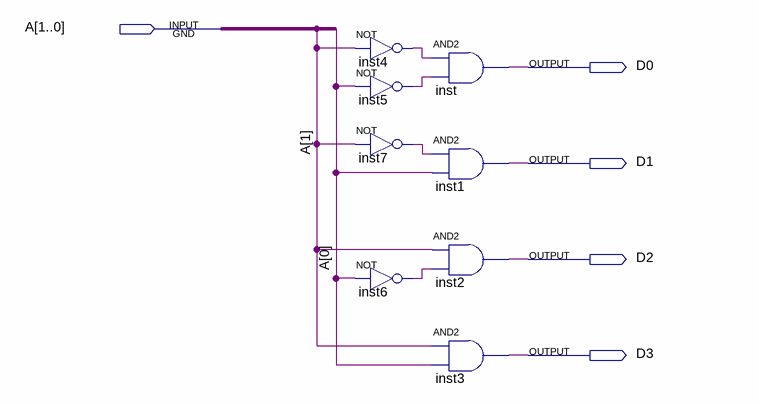
[diagram p0: schematic sheet]
// Quartus schematic dc2_4.bdf as structural Verilog: 8 symbols, 5 pins
module dc2_4 (
  input  [1:0] A,
  output D0,
  output D1,
  output D2,
  output D3
);

  wire inst4_out, inst5_out, inst6_out, inst7_out;

  not inst4 (inst4_out, A[1]);
  not inst5 (inst5_out, A[0]);
  not inst7 (inst7_out, A[1]);
  not inst6 (inst6_out, A[0]);
  and inst (D0, inst4_out, inst5_out);
  and inst1 (D1, inst7_out, A[0]);
  and inst2 (D2, A[1], inst6_out);
  and inst3 (D3, A[1], A[0]);
endmodule
